# Altium schematic sheet audio2.SchDoc
size A4
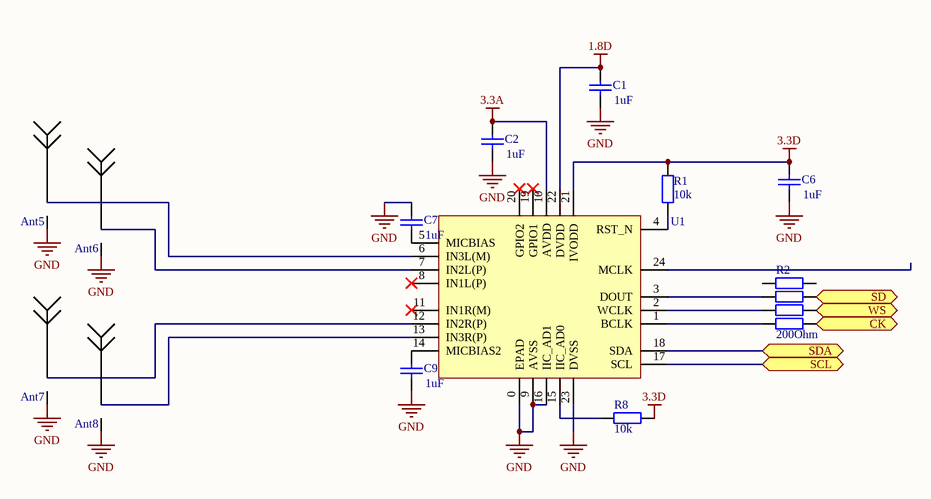
[diagram p0: audio2.SchDoc]

## Parts
Ant5  Antenna  [SMA]  (value not drawn)
Ant6  Antenna  [SMA]  (value not drawn)
Ant7  Antenna  [SMA]  (value not drawn)
Ant8  Antenna  [SMA]  (value not drawn)
C1  1uF  [0402]
C2  1uF  [0402]
C6  1uF  [0402]
C7  1uF  [0402]
C9  1uF  [0402]
R1  value 10k  [0402]  (hidden comment: Res2)
R2  value 200Ohm  [0402X4]  (hidden comment: Res*4)
R8  value 10k  [0402]  (hidden comment: Res2)
U1  TLV320ADC3101  [TLV320ADC3101]  (value not drawn)

## Ports
CK, SCL, SD, SDA, WS

## Nets
1.8D: C1.2 U1.22(DVDD)
3.3A: C2.2 U1.10(AVDD)
3.3D: C6.2 R1.2 R8.1 U1.21(IVODD)
GND: Ant5.GND(G) Ant6.GND(G) Ant7.GND(G) Ant8.GND(G) C1.1 C2.1 C6.1 C7.2 C9.1 U1.0(EPAD) U1.9(AVSS) U1.16(IIC_AD1) U1.23(DVSS)
CK: R2.5 ; port CK
SCL: U1.17(SCL) ; port SCL
SD: R2.7 ; port SD
SDA: U1.18(SDA) ; port SDA
WS: R2.6 ; port WS
NetAnt5_1: Ant5.1 U1.6(IN3L(M))
NetAnt6_1: Ant6.1 U1.7(IN2L(P))
NetAnt7_1: Ant7.1 U1.12(IN2R(P))
NetAnt8_1: Ant8.1 U1.13(IN3R(P))
NetC7_1: C7.1 U1.5(MICBIAS)
NetC9_2: C9.2 U1.14(MICBIAS2)
NetR1_1: R1.1 U1.4(RST_N)
NetR2_2: R2.2 U1.3(DOUT)
NetR2_3: R2.3 U1.2(WCLK)
NetR2_4: R2.4 U1.1(BCLK)
NetR8_2: R8.2 U1.15(IIC_AD0)

Not connected (* = marked no-connect by the designer): R2 1 8; U1 8(IN1L(P))* 11(IN1R(M))* 19(GPIO1)* 20(GPIO2)* 24(MCLK)

## Library data of the parts
C1 C2 C6 C7 C9 = Cap: Capacitor
R1 R8 = Res2: Resistor; Published: 8-Jun-2000; LatestRevisionDate: 17-Jul-2002; LatestRevisionNote: Re-released for DXP Platform.; PackageReference: AXIAL-0.4; Publisher: Altium Limited; PackageDescription: Axial Device, Thru-Hole; 2 Leads; 0.4 in Pin Spacing
R2 = Res*4: Resistor; Published: 8-Jun-2000; LatestRevisionDate: 17-Jul-2002; LatestRevisionNote: Re-released for DXP Platform.; PackageReference: AXIAL-0.4; Publisher: Altium Limited; PackageDescription: Axial Device, Thru-Hole; 2 Leads; 0.4 in Pin Spacing